# EAGLE design color_sensor (EAGLE 5.06)
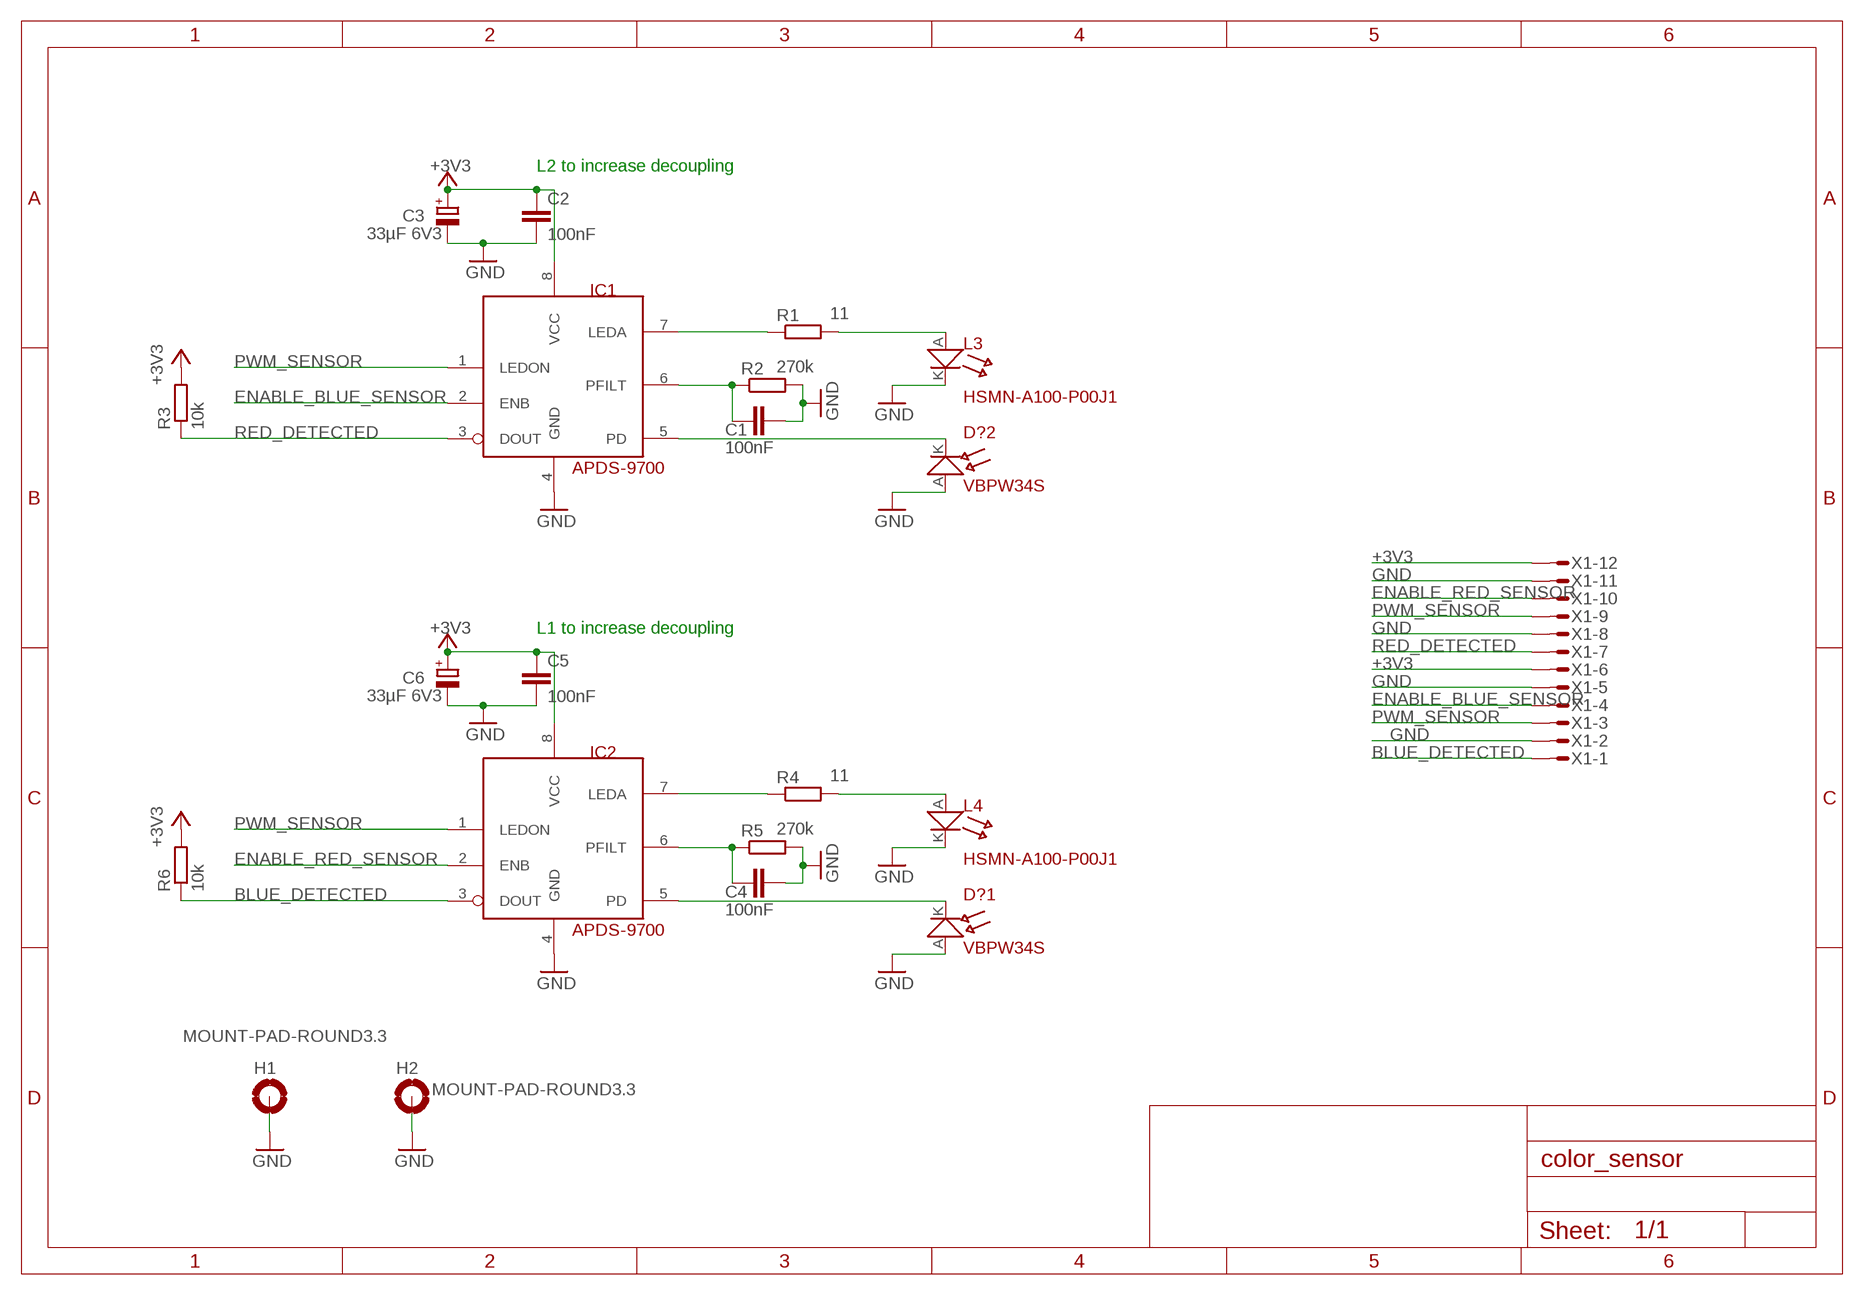
[diagram p0: schematic, sheet 1]

## Parts
C1  100nF  C-EUC0805  [C0805]
C2  100nF  C-EUC0603  [C0603]
C3  33µF 6V3  CPOL-EUSMCB  [SMC_B]
C4  100nF  C-EUC0805  [C0805]
C5  100nF  C-EUC0603  [C0603]
C6  33µF 6V3  CPOL-EUSMCB  [SMC_B]
D?1  VBPW34S  [VBPW34S]
D?2  VBPW34S  [VBPW34S]
H1  MOUNT-PAD-ROUND3.3  [3,3-PAD]
H2  MOUNT-PAD-ROUND3.3  [3,3-PAD]
IC1  APDS-9700  [QFN8]
IC2  APDS-9700  [QFN8]
L3  HSMN-A100-P00J1  [PLCC-2]
L4  HSMN-A100-P00J1  [PLCC-2]
R1  11  R-EU_R0603  [R0603]
R2  270k  R-EU_R0805  [R0805]
R3  10k  R-EU_R0805  [R0805]
R4  11  R-EU_R0805  [R0805]
R5  270k  R-EU_R0805  [R0805]
R6  10k  R-EU_R0805  [R0805]
X1  MICROMATCH-12_SMD  [MICROMATCH-12_SMD]

## Nets
+3V3: C2.1 C3.+ C5.1 C6.+ IC1.8(VCC) IC2.8(VCC) R3.2 R6.2 X1.6 X1.12
BLUE_DETECTED: IC2.3(DOUT) R6.1 X1.1
ENABLE_BLUE_SENSOR: IC1.2(ENB) X1.4
ENABLE_RED_SENSOR: IC2.2(ENB) X1.10
GND: C1.2 C2.2 C3.- C4.2 C5.2 C6.- D?1.A D?2.A H1.B3,3(MOUNT) H2.B3,3(MOUNT) IC1.4(GND) IC2.4(GND) L3.K L4.K R2.2 R5.2 X1.2 X1.5 X1.8 X1.11
N$1: D?2.K IC1.5(PD)
N$2: C1.1 IC1.6(PFILT) R2.1
N$3: D?1.K IC2.5(PD)
N$4: IC1.7(LEDA) R1.1
N$5: L3.A R1.2
N$6: C4.1 IC2.6(PFILT) R5.1
N$7: IC2.7(LEDA) R4.1
N$8: L4.A R4.2
PWM_SENSOR: IC1.1(LEDON) IC2.1(LEDON) X1.3 X1.9
RED_DETECTED: IC1.3(DOUT) R3.1 X1.7

## Notes on the sheet
- L2 to increase decoupling
- L1 to increase decoupling

## Library data of the parts
C1 C2 C4 C5 = rcl:C-EU: CAPACITOR, European symbol
C3 C6 = rcl:CPOL-EU: POLARIZED CAPACITOR, European symbol
D?1 D?2 = robotter:VBPW34S
H1 H2 = holes:MOUNT-PAD-ROUND: MOUNTING PAD, round
IC1 IC2 = robotter:APDS-9700
L3 L4 = robotter:HSMN-A100-P00J1
R1-R6 = rcl:R-EU_: RESISTOR, European symbol
X1 = robotter:MICROMATCH-12_SMD: Micromatch 12 ways surface mount connector Amphenol : TMM-6-0-12-1 or TE connectivity ref : 8-188275-2

## Board
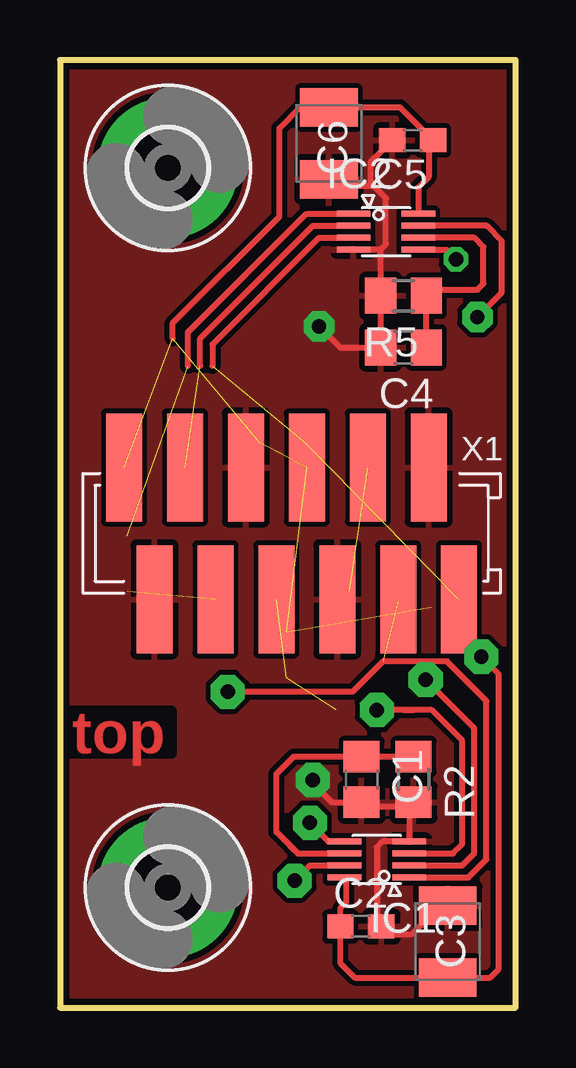
[diagram p1: board, top side]
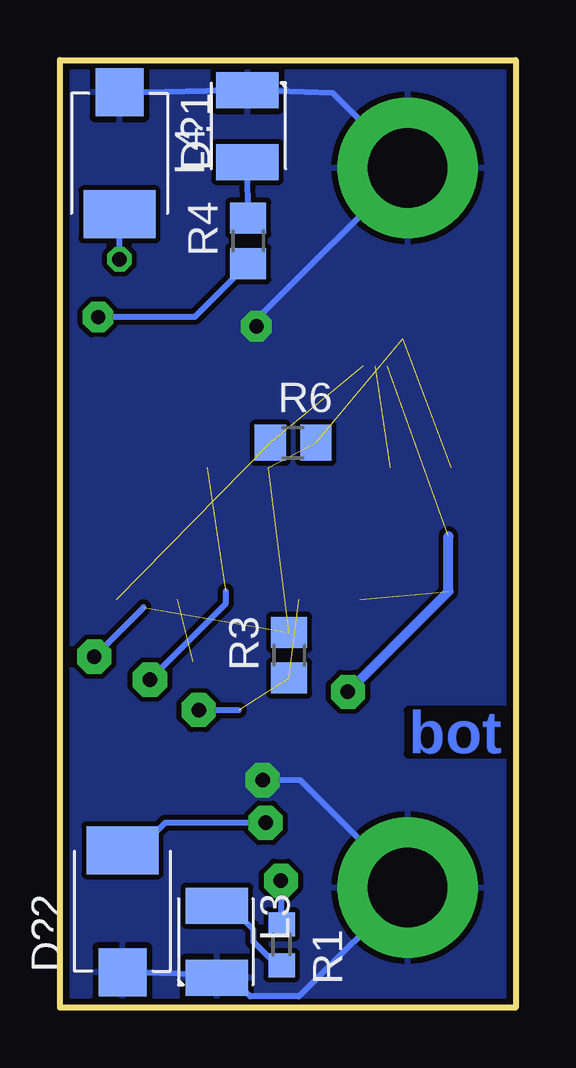
[diagram p2: board, bottom side, seen from below]

Size 19 x 39.5 mm. Coordinates in mm from the lower left corner, seen from the top.
Outline: 0,0 19,0 19,39.5 0,39.5 0,0
Copper layers (1*16): Top 0.035mm / dielectric 1.5mm / Bottom 0.035mm
Design rules "default *": minimum track width 8mil, minimum drill 0.6mm, track to track 8mil, track to pad 8mil, pad to pad 8mil, via to via 8mil, smd to smd 8mil, copper to edge 10mil, drill to drill 8mil, minimum pad ring 10mil, minimum via ring 8mil, stop-mask expansion 4mil, vias tented up to drill 0mil, thermal gap 10mil

### Footprints (pad centres in the part's own frame; a part is rotated, then mirrored left to right if it is on the bottom)
C0805 = smd 1.3 x 1.5: 1 -0.95,0; 2 0.95,0
C0603 = smd 1.1 x 1: 1 -0.85,0; 2 0.85,0
SMC_B = smd 1.6 x 2.4: + -1.5,0; - 1.5,0
VBPW34S = smd 2 x 2: A -2.54,0 | smd 2 x 3: K 2.54,0
3,3-PAD = drill 3.3 pad 5.842 round: B3,3 0,0
QFN8 = smd 1.4 x 0.25: 1 -1.35,0.75; 2 -1.35,0.25; 3 -1.35,-0.25; 4 -1.35,-0.75; 5 1.35,-0.75; 6 1.35,-0.25; 7 1.35,0.25; 8 1.35,0.75
PLCC-2 = smd 1.5 x 2.6: A -1.5,0; K 1.5,0
R0603 = smd 1 x 1.1: 1 -0.85,0; 2 0.85,0
R0805 = smd 1.3 x 1.5: 1 -0.95,0; 2 0.95,0
MICROMATCH-12_SMD = smd 1.5 x 4.5: 1 6.985,-2.75; 2 5.715,2.75; 3 4.445,-2.75; 4 3.175,2.75; 5 1.905,-2.75; 6 0.635,2.75; 7 -0.635,-2.75; 8 -1.905,2.75; 9 -3.175,-2.75; 10 -4.445,2.75; 11 -5.715,-2.75; 12 -6.985,2.75

### Placement (x,y rotation side)
C1  12.58,9.51 270 top
C2  12.55,3.38 0 top
C3  16.17,2.75 90 top
C4  14.33,27.51 180 top
C5  14.71,36.15 180 top
C6  11.22,36.02 270 top
D?1  16.52,35.61 270 bottom
D?2  16.39,4.02 90 bottom
H1  4.5,5 0 top
H2  4.5,35 0 top
IC1  13.22,6.18 180 top
IC2  13.6,32.34 0 top
L3  12.45,2.75 270 bottom
L4  11.18,36.75 90 bottom
R1  9.75,2.62 270 bottom
R2  14.74,9.51 270 top
R3  9.44,14.68 90 bottom
R4  11.15,31.96 90 bottom
R5  14.33,29.67 180 top
R6  9.28,23.54 0 bottom
X1  9.66,19.77 0 top

### Tracks (layer width: path | path; a pad name or v marks a point on that pad's centre or on a via)
+3V3  (via drill 0.6 pad 1.42)  (5 unrouted)
  Top 0.254: v17.57,14.62 18.3,13.9 18.3,1.6 17.94,1.25 C3.+ 12.3,1.25 11.7,1.85 C2.1 11.7,4.15 11.95,4.4 11.95,5.35 IC1.8 | IC2.8 14.95,34.2 15.38,34.62 15.38,35.97 C5.1 14.18,37.52 C6.+ 10.02,37.52 9.15,36.66 9.15,32.97 4.71,28.53 4.71,27.89
  Bottom 0.254: v17.57,14.62 15.51,16.68
BLUE_DETECTED  (2 unrouted)
  Top 0.254: IC2.3 10.81,32.09 6.36,27.64 6.36,26.75
ENABLE_BLUE_SENSOR  (via drill 0.6 pad 1.42)  (1 unrouted)
  Top 0.254: IC1.2 16.78,5.93 17.28,6.43 17.28,11.64 v15.25,13.67
  Bottom 0.254: v15.25,13.67 12.07,16.84 12.07,17.35
ENABLE_RED_SENSOR  (1 unrouted)
  Top 0.254: IC2.2 10.54,32.59 5.85,27.89 5.85,26.75
GND  (via drill 0.6 pad 1.27, 0.6 pad 1.42)
  Top 0.254: 13.22,3.06 C2.2 | 14.57,8.39 IC1.4 13.46,6.93 13.22,6.68 13.22,3.06 | 14.57,8.39 R2.2 | 14.57,8.39 12.63,8.39 C1.2 11.34,8.56 10.55,9.35 v10.55,9.48 | 13.22,3.06 14.67,3.06 15.5,3.89 15.81,3.89 C3.- | 13.36,31.59 IC2.4 | 13.36,31.59 13.6,31.83 13.6,33.73 13.09,34.24 12.96,34.24 | 10.73,34.24 C6.- | 12.96,34.24 12.97,34.25 12.97,35.26 C5.2 | 12.96,34.24 10.73,34.24 | 10.73,34.24 10.73,35 | 13.36,31.59 13.38,31.57 R5.2 C4.2 11.69,27.51 v10.8,28.4
  Bottom 0.254: D?2.A 12.56,1.37 L3.K 11.84,1.25 11.06,0.46 9.04,0.46 H1.B3,3 8.98,9.48 v10.55,9.48 | D?1.A 16.39,38.12 L4.K 7.62,38.12 H2.B3,3 10.8,28.7 v10.8,28.4
  pour Top: -0.5,0 19.57,0 19.57,34.84 19.44,39.5 -0.5,39.5
  pour Bottom: -0.5,0 19.44,0 19.44,39.5 -0.5,39.5
N$1  (via drill 0.6 pad 1.42)
  Top 0.254: IC1.5 11.2,6.93 v10.42,7.7
  Bottom 0.254: D?2.K 15.76,6.56 14.61,7.7 v10.42,7.7
N$2
  Top 0.254: 9.34,7 9.03,7.32 9.03,9.73 9.75,10.46 C1.1 R2.1 | 9.34,7 9.79,6.56 | IC1.6 9.92,6.43 9.34,7
N$3  (via drill 0.6 pad 1.02)
  Top 0.254: IC2.5 16.12,31.59 v16.52,31.2
  Bottom 0.254: v16.52,31.2 D?1.K
N$4  (via drill 0.6 pad 1.42)
  Top 0.254: IC1.7 10.43,5.93 v9.79,5.29
  Bottom 0.254: v9.79,5.29 9.75,4.75 R1.1
N$5
  Bottom 0.254: R1.2 9.95,1.77 10.93,2.75 10.93,3.26 11.44,3.76 11.97,3.76 L3.A
N$6
  Top 0.254: IC2.6 17.28,32.09 17.66,31.7 17.66,30.18 17.41,29.92 15.53,29.92 R5.1 C4.1
N$7  (via drill 0.6 pad 1.27)
  Top 0.254: IC2.7 17.79,32.59 18.42,31.96 18.42,29.8 v17.41,28.78
  Bottom 0.254: v17.41,28.78 13.38,28.78 R4.1
N$8
  Bottom 0.254: L4.A 11.18,35.03 R4.2
PWM_SENSOR  (via drill 0.6 pad 1.42)  (3 unrouted)
  Top 0.254: v6.99,13.16 12.2,13.16 13.47,14.43 16.14,14.43 17.79,12.78 17.79,6.18 17.04,5.43 IC1.1 | IC2.1 10.28,33.09 5.34,28.15 5.34,26.75
  Bottom 0.406: 2.8,19.65 2.8,17.35 v6.99,13.16
RED_DETECTED  (via drill 0.6 pad 1.42)  (2 unrouted)
  Top 0.254: IC1.3 16.39,6.43 16.77,6.81 16.77,11.13 15.5,12.4 14.36,12.4 | 14.36,12.4 v13.22,12.4 | 14.36,12.4 14.74,12.4
  Bottom 0.254: v13.22,12.4 11.53,12.4

### Text on the board
Top: top
Bottom: bot